# Altium schematic sheet CONNECTv1.4.SchDoc
size A3
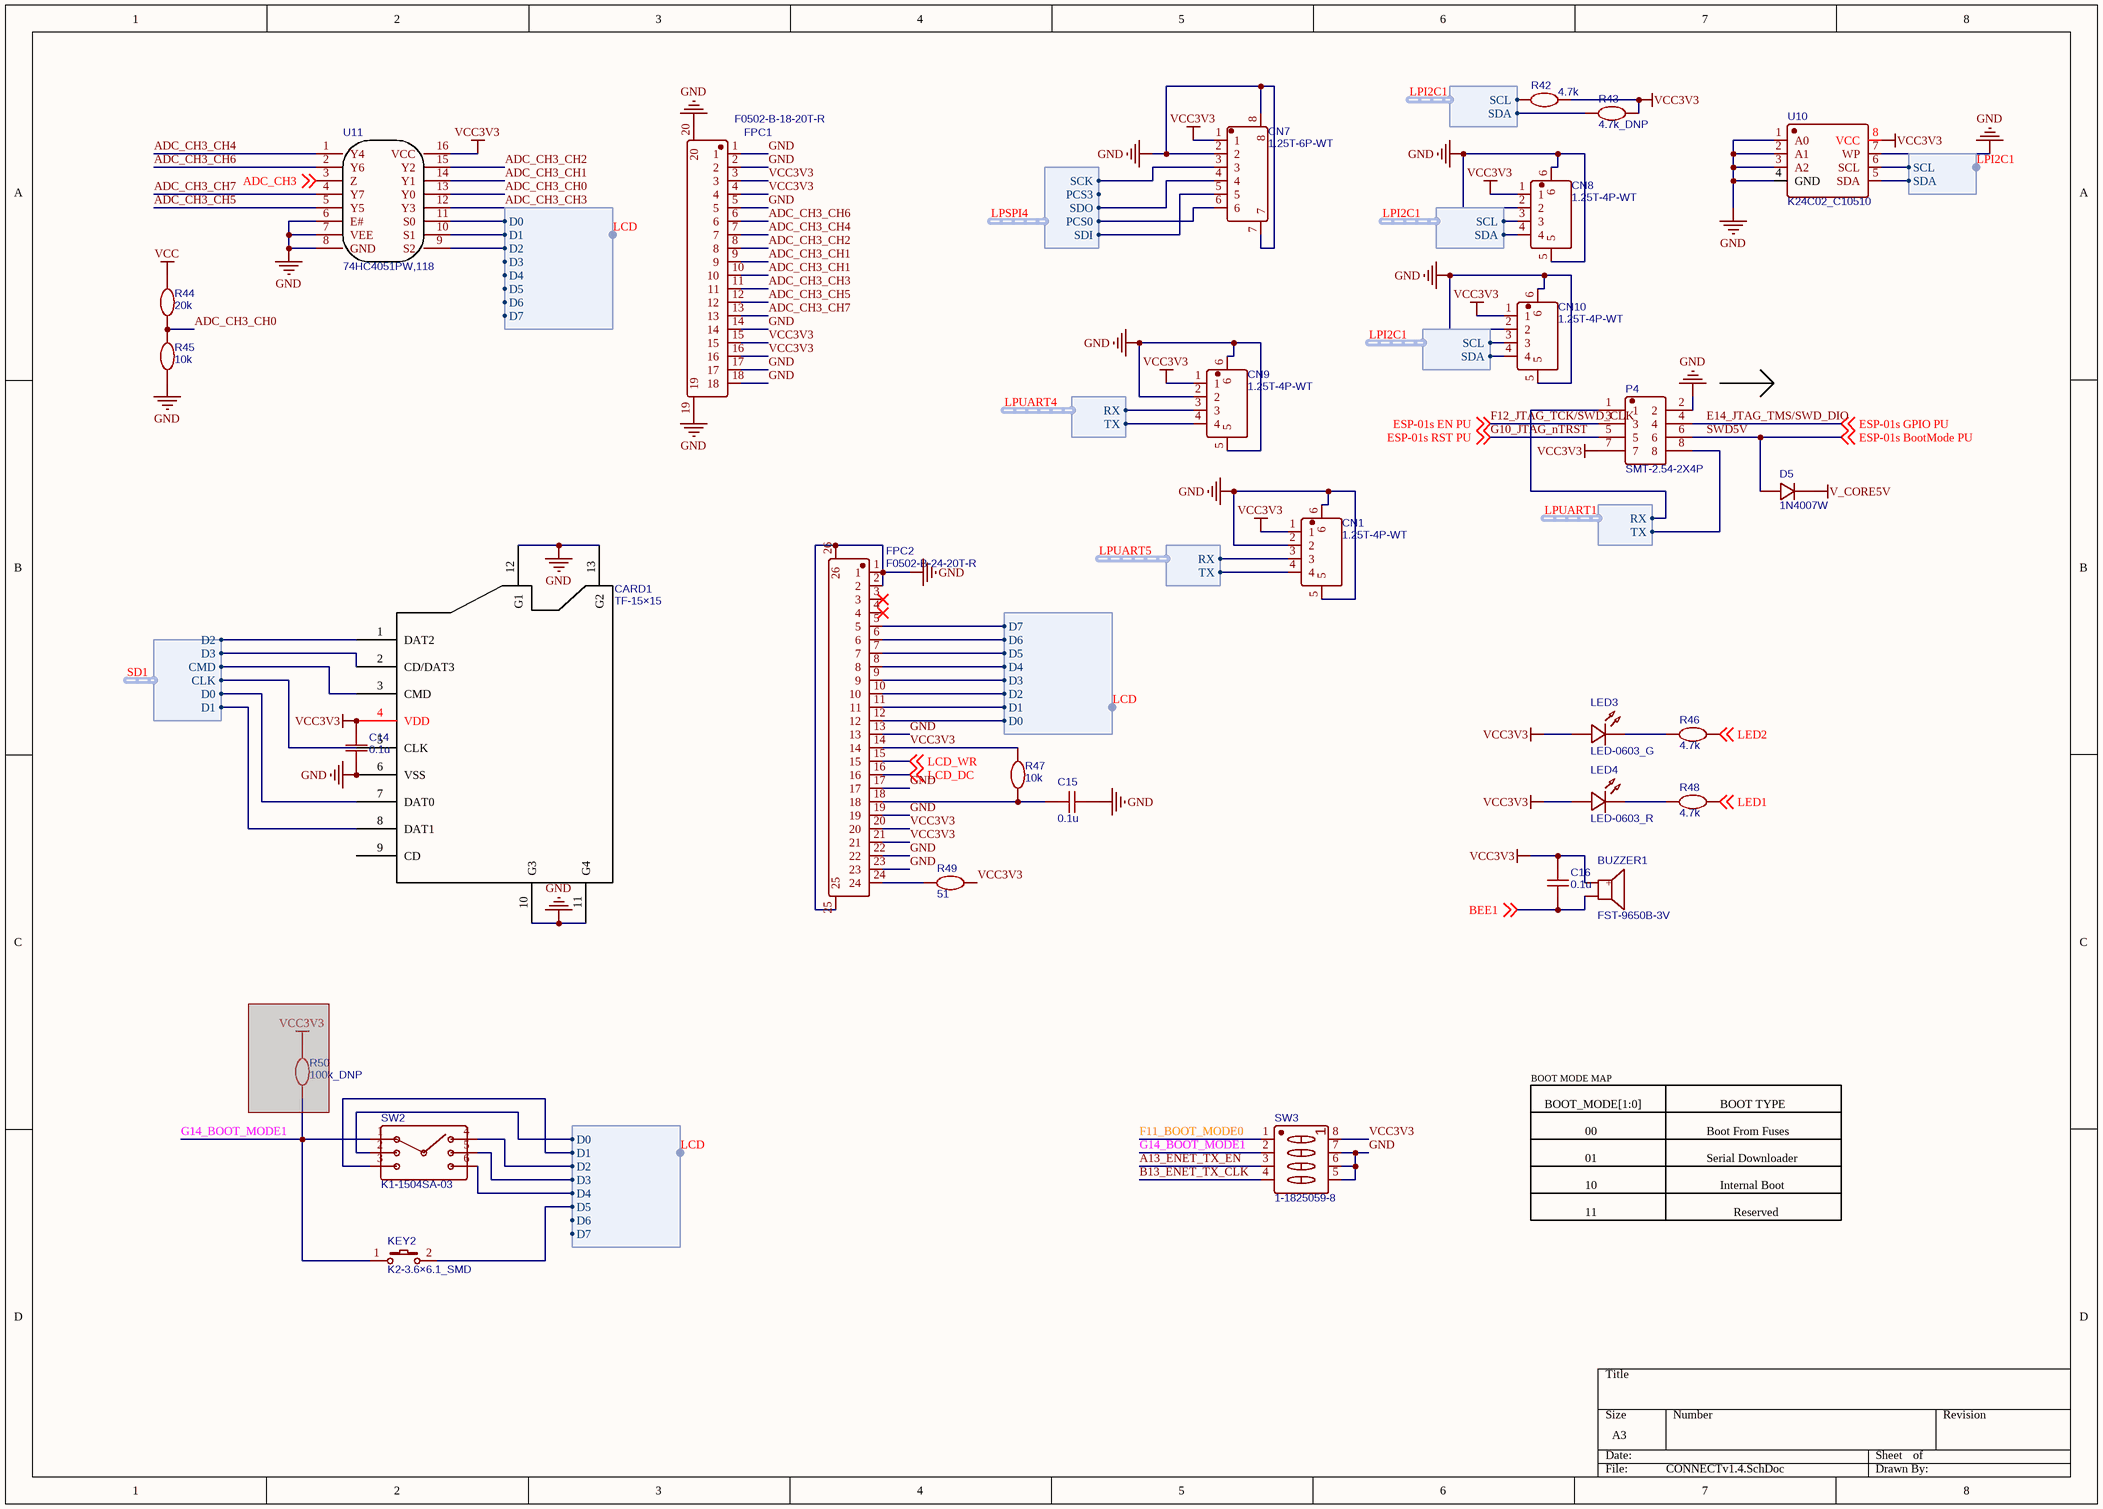
[diagram p0: CONNECTv1.4.SchDoc]

## Parts
BUZZER1  FST-9650B-3V  [BUZ-SMD_L9.6-W9.6-LS10.0-R]
C14  0.1u  [C0603]
C15  0.1u  [C0603]
C16  0.1u  [C0603]
CARD1  TF-15×15  [PCBComponent_1 - duplicate]
CN1  1.25T-4P-WT  [CONN-SMD_4P-1.25P_1.25T-4P]
CN7  1.25T-6P-WT  [CONN-SMD_6P-P1.25_1.25T-6P-WT]
CN8  1.25T-4P-WT  [CONN-SMD_4P-1.25P_1.25T-4P]
CN9  1.25T-4P-WT  [CONN-SMD_4P-1.25P_1.25T-4P]
CN10  1.25T-4P-WT  [CONN-SMD_4P-1.25P_1.25T-4P]
D5  1N4007W  [SOD-123_L2.8-W1.8-LS3.7-RD]
FPC1  F0502-B-18-20T-R  [FPC-SMD_18P-P0.50_F0502-B-18-20T-R]
FPC2  F0502-B-24-20T-R  [FPC-SMD_24P-P0.50_F0502-B-24-20T-R]
KEY2  K2-3.6×6.1_SMD  [KEY-SMD_2P-L6.2-W3.6-LS8.0]
LED3  LED-0603_G  [LED0603_GREEN]
LED4  LED-0603_R  [LED0603_RED]
P4  SMT-2.54-2X4P  [SMT-2.54-2X4P]
R42  4.7k  [R0603]
R43  4.7k_DNP  [R0603]
R44  20k  [R0603]
R45  10k  [R0603]
R46  4.7k  [R0603]
R47  10k  [R0603]
R48  4.7k  [R0603]
R49  51  [R0603]
R50  100k_DNP  [R0603]  (masked out: inside a compile mask, not in the netlist)
SW2  K1-1504SA-03  [SW-TH_K1-1504SA-03]
SW3  1-1825059-8  [SW-TH_1-1825059-8]
U10  K24C02_C10510  [SOIC-8_L4.9-W3.9-P1.27-LS6.0-BL]
U11  74HC4051PW,118  [TSSOP-16_L5.0-W4.4-P0.65-LS6.4-BL]

## Harnesses
data: D0, D1, D2, D3, D4, D5, D6, D7
SDHC: D1, D0, CLK, CMD, D3, D2
SPI: SDI, SDO, SCK, PCS0, PCS3
I2C: SDA, SCL
uart: TX, RX

## Nets
GND: C14.1 C15.1 CARD1.6(VSS) CARD1.10(G3) CARD1.11(G4) CARD1.12(G1) CARD1.13(G2) CN1.2 CN1.5 CN1.6 CN7.2 CN7.7 CN7.8 CN8.2 CN8.5 CN8.6 CN9.2 CN9.5 CN9.6 CN10.2 CN10.5 CN10.6 FPC1.1 FPC1.2 FPC1.5 FPC1.14 FPC1.17 FPC1.18 FPC1.19 FPC1.20 FPC2.1 FPC2.2 FPC2.13 FPC2.17 FPC2.19 FPC2.22 FPC2.23 FPC2.25 FPC2.26 P4.2 R45.1 SW3.5(PIN5) SW3.6(PIN6) SW3.7(PIN7) U10.1(A0) U10.2(A1) U10.3(A2) U10.4(GND) U10.7(WP) U11.6(E#) U11.7(VEE) U11.8(GND)
V_CORE5V: D5.1
VCC: R44.2
VCC3V3: BUZZER1.1(+) C14.2 C16.2 CARD1.4(VDD) CN1.1 CN7.1 CN8.1 CN9.1 CN10.1 FPC1.3 FPC1.4 FPC1.15 FPC1.16 FPC2.14 FPC2.20 FPC2.21 LED3.1 LED4.1 P4.7 R42.2 R43.2 R47.2 R49.1 SW3.8(PIN8) U10.8(VCC) U11.16(VCC)
A13_ENET_TX_EN: SW3.3(PIN3)
ADC_CH3: U11.3(Z) ; off-sheet ADC_CH3
ADC_CH3_CH0: R44.1 R45.2 U11.13(Y0)
ADC_CH3_CH1: FPC1.9 FPC1.10 U11.14(Y1)
ADC_CH3_CH2: FPC1.8 U11.15(Y2)
ADC_CH3_CH3: FPC1.11 U11.12(Y3)
ADC_CH3_CH4: FPC1.7 U11.1(Y4)
ADC_CH3_CH5: FPC1.12 U11.5(Y5)
ADC_CH3_CH6: FPC1.6 U11.2(Y6)
ADC_CH3_CH7: FPC1.13 U11.4(Y7)
B13_ENET_TX_CLK: SW3.4(PIN4)
BEE1: BUZZER1.2 C16.1 ; off-sheet BEE1
E14_JTAG_TMS/SWD_DIO: P4.4 ; off-sheet ESP-01s GPIO PU  [also labelled ESP-01s GPIO PU]
F11_BOOT_MODE0: SW3.1(PIN1)
F12_JTAG_TCK/SWD_CLK: P4.3 ; off-sheet ESP-01s EN PU  [also labelled ESP-01s EN PU]
G10_JTAG_nTRST: P4.5 ; off-sheet ESP-01s RST PU  [also labelled ESP-01s RST PU]
G14_BOOT_MODE1: KEY2.1 SW2.1(A) SW3.2(PIN2)
LCD.D0: FPC2.12 SW2.2(B) U11.11(S0) ; harness data.D0
LCD.D1: FPC2.11 SW2.3(C) U11.10(S1) ; harness data.D1
LCD.D2: FPC2.10 SW2.4(CENTER) U11.9(S2) ; harness data.D2
LCD.D3: FPC2.9 SW2.5(D) ; harness data.D3
LCD.D4: FPC2.8 SW2.6(COMMON) ; harness data.D4
LCD.D5: FPC2.7 KEY2.2 ; harness data.D5
LCD.D6: FPC2.6 ; harness data.D6
LCD.D7: FPC2.5 ; harness data.D7
LCD_DC: FPC2.16 ; off-sheet LCD_DC
LCD_WR: FPC2.15 ; off-sheet LCD_WR
LED1: R48.2 ; off-sheet LED1
LED2: R46.2 ; off-sheet LED2
LPI2C1.SCL: CN8.3 CN10.3 R42.1 U10.6(SCL) ; harness I2C.SCL
LPI2C1.SDA: CN8.4 CN10.4 R43.1 U10.5(SDA) ; harness I2C.SDA
LPSPI4.PCS0: CN7.6 ; harness SPI.PCS0
LPSPI4.SCK: CN7.3 ; harness SPI.SCK
LPSPI4.SDI: CN7.5 ; harness SPI.SDI
LPSPI4.SDO: CN7.4 ; harness SPI.SDO
LPUART1.RX: P4.1 ; harness uart.RX
LPUART1.TX: P4.8 ; harness uart.TX
LPUART4.RX: CN9.3 ; harness uart.RX
LPUART4.TX: CN9.4 ; harness uart.TX
LPUART5.RX: CN1.3 ; harness uart.RX
LPUART5.TX: CN1.4 ; harness uart.TX
SD1.CLK: CARD1.5(CLK) ; harness SDHC.CLK
SD1.CMD: CARD1.3(CMD) ; harness SDHC.CMD
SD1.D0: CARD1.7(DAT0) ; harness SDHC.D0
SD1.D1: CARD1.8(DAT1) ; harness SDHC.D1
SD1.D2: CARD1.1(DAT2) ; harness SDHC.D2
SD1.D3: CARD1.2(CD/DAT3) ; harness SDHC.D3
SWD5V: D5.2 P4.6 ; off-sheet ESP-01s BootMode PU  [also labelled ESP-01s BootMode PU]
NetC15_2: C15.2 FPC2.18 R47.1
NetFPC2_24: FPC2.24 R49.2
NetLED3_2: LED3.2 R46.1
NetLED4_2: LED4.2 R48.1

Not connected (* = marked no-connect by the designer): CARD1 9(CD); FPC2 3* 4*

## Notes on the sheet
- BOOT MODE MAP
- BOOT_MODE[1:0]
- BOOT TYPE
- 00
- 01
- 10
- Boot From Fuses
- Serial Downloader
- Internal Boot
- 11
- Reserved

## Library data of the parts
BUZZER1 = FST-9650B-3V: BOM_Manufacturer: FUET; Contributor: LCSC; BOM_Supplier: LCSC; BOM_Supplier Part: C391032; BOM_Manufacturer Part: FST-9650B-3V; spicePre: B; spiceSymbolName: FST-9650B-3V
C14-C16 = C0603: nameAlias: Value(F); Contributor: LCEDA_Lib; spicePre: C; spiceSymbolName: C_0603_US
CARD1 = TF-15×15: BOM_Manufacturer: SOFNG; BOM_Supplier: LCSC; BOM_Manufacturer Part: TF-15×15; BOM_Supplier Part: C111196; spicePre: C; spiceSymbolName: TF-15×15
CN1 CN8-CN10 = 1.25T-4P-WT: BOM_Manufacturer: HRO; Contributor: LCSC; BOM_Supplier: LCSC; BOM_Manufacturer Part: 1.25T-4P-WT; BOM_Supplier Part: C125739; spicePre: C; spiceSymbolName: 1.25T-4P-WT
CN7 = 1.25T-6P-WT: BOM_Manufacturer: HRO; BOM_Supplier: LCSC; BOM_Manufacturer Part: 1.25T-6P-WT; BOM_Supplier Part: C97377; spicePre: C; spiceSymbolName: 1.25T-6P-WT
D5 = 1N4007W: BOM_Manufacturer: BLUE ROCKET; Contributor: LCEDA_Lib; BOM_Supplier: LCSC; BOM_Supplier Part: C328592; BOM_Manufacturer Part: 1N4007W; spicePre: D; spiceSymbolName: 1N4007W
FPC1 = F0502-B-18-20T-R: BOM_Manufacturer: XFCN; Contributor: LCSC; BOM_Supplier: LCSC; BOM_Supplier Part: C512918; BOM_Manufacturer Part: F0502-B-18-20T-R; spicePre: F; spiceSymbolName: F0502-B-18-20T-R
FPC2 = F0502-B-24-20T-R: BOM_Manufacturer: XFCN; Contributor: LCSC; BOM_Supplier: LCSC; BOM_Supplier Part: C512919; BOM_Manufacturer Part: F0502-B-24-20T-R; spicePre: F; spiceSymbolName: F0502-B-24-20T-R
KEY2 = K2-3.6×6.1_SMD: BOM_Manufacturer Part: K2-1107ST-A4SW-06; Contributor: LCEDA_Lib; 制造商: 韩国韩荣; BOM_Supplier Part: C118141; BOM_Supplier: LCSC; spicePre: K; spiceSymbolName: K2-3.6×6.1_SMD
LED3 = LED-0603_G: BOM_Manufacturer: EVERLIGHT(台湾亿光); BOM_Manufacturer Part: 19-217/GHC-YR1S2/3T; Contributor: LCEDA_Lib; BOM_Supplier Part: C72043; BOM_Supplier: LCSC; spicePre: L; spiceSymbolName: LED-0603_G
LED4 = LED-0603_R: BOM_Manufacturer: EVERLIGHT(台湾亿光); BOM_Manufacturer Part: 19-217/R6C-AL1M2VY/3T; Contributor: LCEDA_01; BOM_Supplier Part: C72044; BOM_Supplier: LCSC; spicePre: L; spiceSymbolName: LED-0603_R
P4 = SMT-2.54-2X4P: Contributor: before_light; BOM_Supplier: null; BOM_Supplier Part: 2x4P; spicePre: P; spiceSymbolName: SMT-2.54-2X4P
R42-R50 = R0603: nameAlias: Value(Ω); Contributor: LCEDA_Lib; spicePre: R; spiceSymbolName: R_0603_EU
SW2 = 五向-大: BOM_Manufacturer: HRO; Contributor: LCSC; BOM_Supplier: LCSC; BOM_Manufacturer Part: K1-1504SA-03; BOM_Supplier Part: C145913; spicePre: S; spiceSymbolName: K1-1504SA-03
SW3 = switch: BOM_Manufacturer: TE Connectivity; Contributor: LCSC; BOM_Supplier: LCSC; BOM_Supplier Part: C266185; BOM_Manufacturer Part: 1-1825059-8; spicePre: S; spiceSymbolName: 1-1825059-8
U10 = K24C02_C10510: BOM_Manufacturer: Hua Hong NEC; BOM_Manufacturer Part: K24C02; BOM_Supplier: LCSC; image: //image.lceda.cn/szlcsc/C10510.jpg; BOM_Supplier Part: C10510; spicePre: U; spiceSymbolName: K24C02_C10510
U11 = 74HC4051PW,118: BOM_Manufacturer: Nexperia; SMT Type: Extend; BOM_Supplier: LCSC; BOM_Manufacturer Part: 74HC4051PW,118; image: //image.lceda.cn/szlcsc/C5645.jpg; BOM_Supplier Part: C5645; BOM_LCSC Assembly: Yes; spicePre: U; spiceSymbolName: 74HC4051PW,118